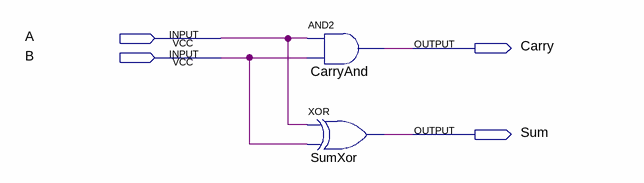
[diagram p0: schematic sheet]
// Quartus schematic halfadder.bdf as structural Verilog: 2 symbols, 4 pins
module halfadder (
  input  A,
  input  B,
  output Carry,
  output Sum
);

  and CarryAnd (Carry, A, B);
  xor SumXor (Sum, A, B);
endmodule
